# Altium project Eink.PrjPcb
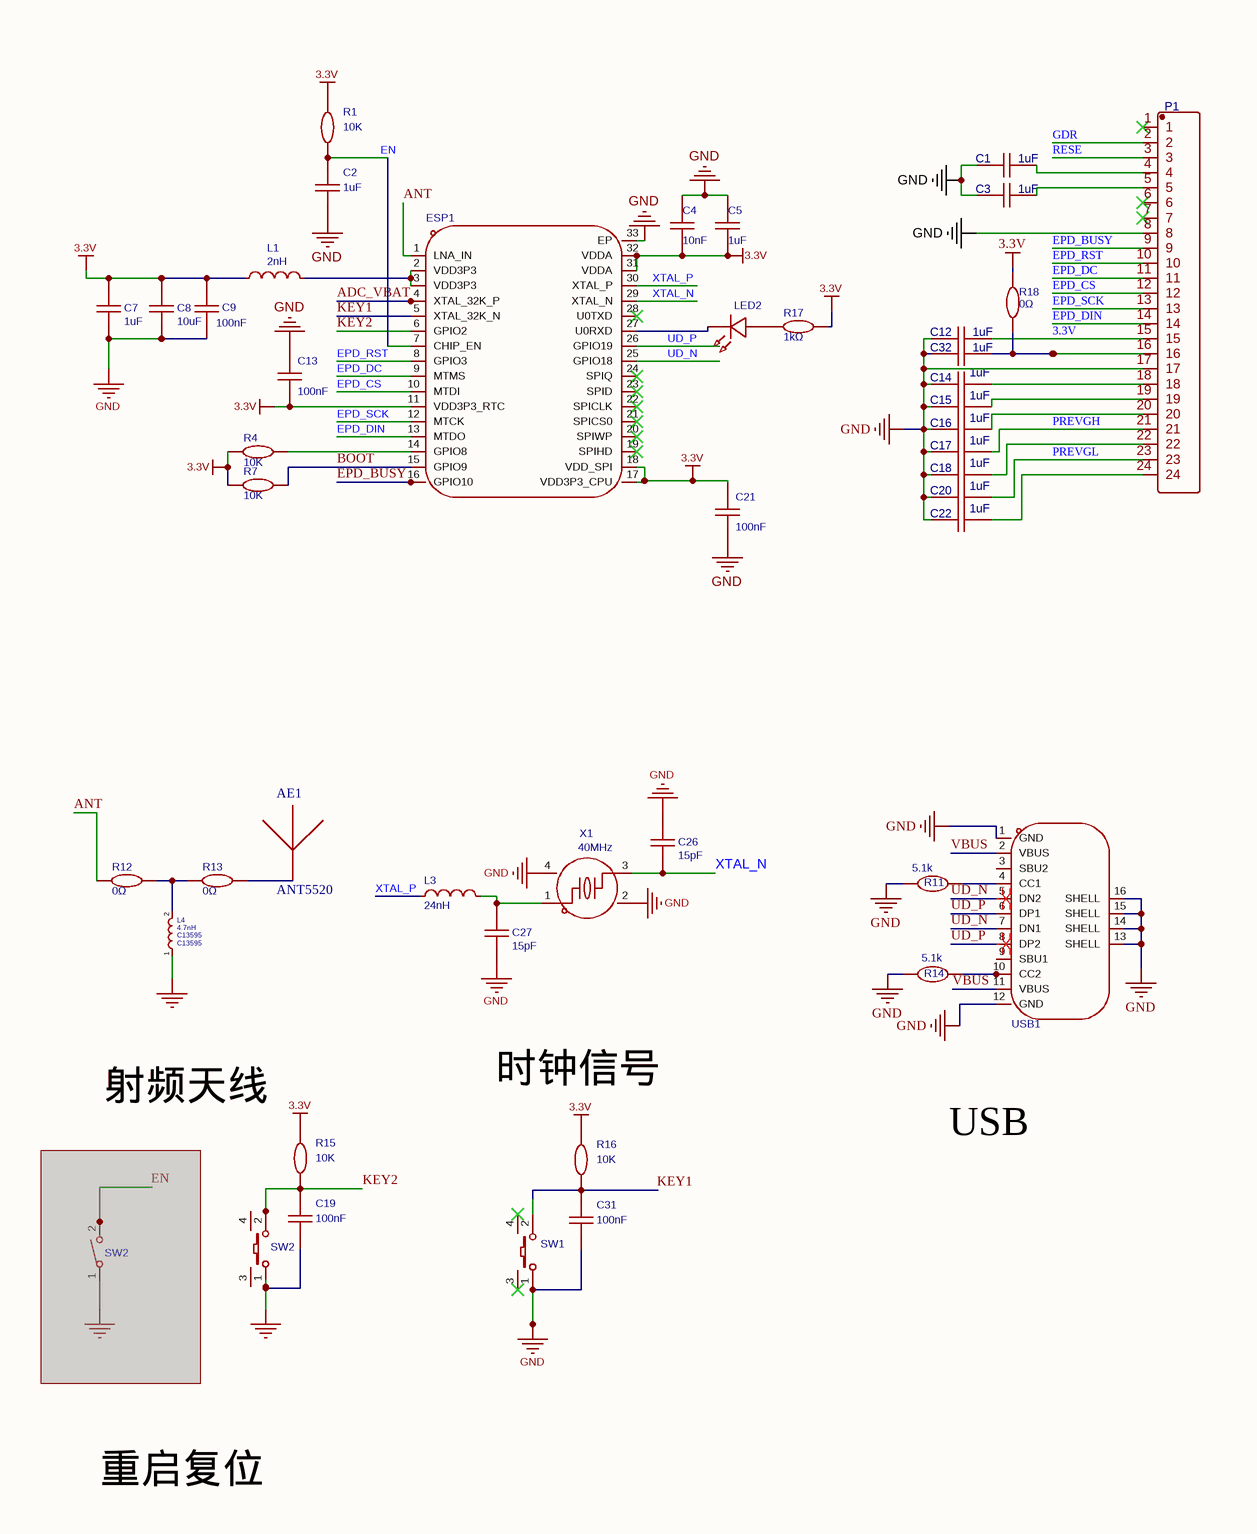
[diagram p0: Eink1.1.SchDoc, left]
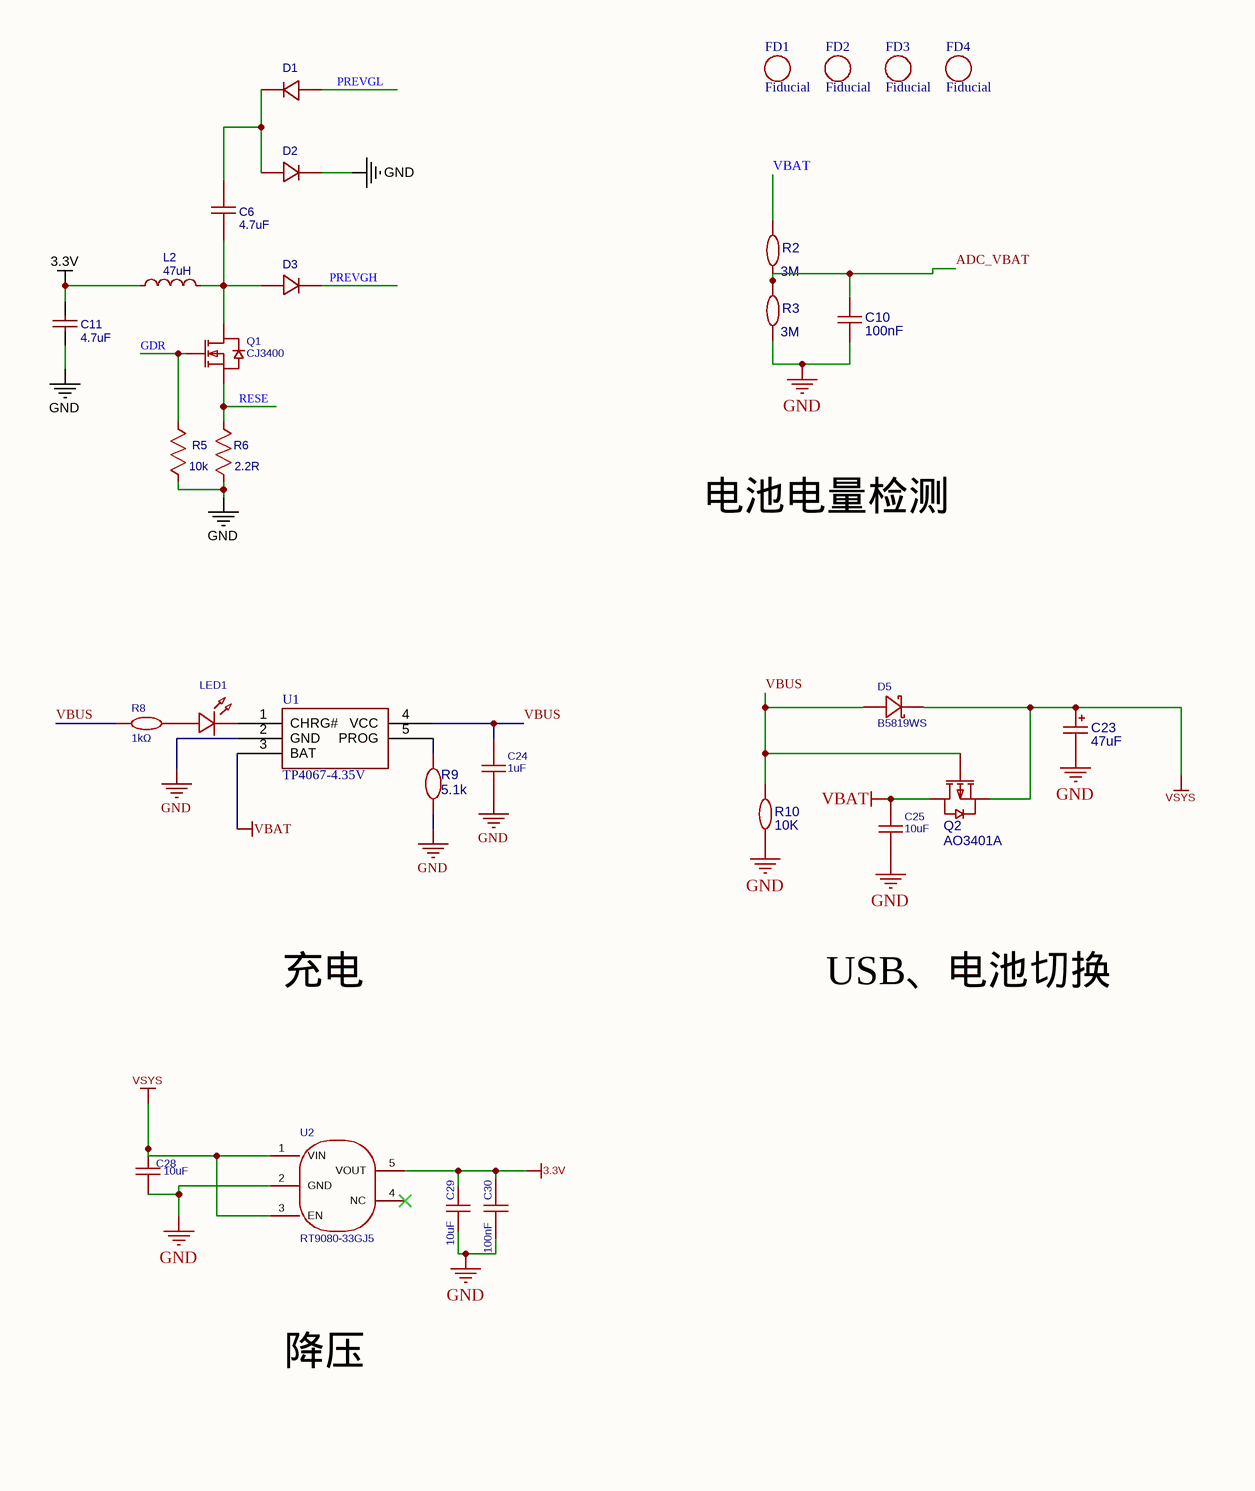
[diagram p1: Eink1.1.SchDoc, right]
1 sheet, 76 parts. Net scope: global (net labels, ports and power ports of the same name join across sheets).
Board file: Eink1.1.PcbDoc

## Sheet Eink1.1.SchDoc
size 431 x 279 mm; SheetNumber: 1; SheetTotal: 1

### Parts
(Parts that share a designator on the sheet are numbered #1, #2 ... from top to bottom, then left to right.)
AE1  ANT5520  [ANT_5520]
C1  1uF  [C0402]
C2  1uF  [C0402]
C3  1uF  [C0402]
C4  10nF  [C0402]
C5  1uF  [C0402]
C6  4.7uF  [C0402]
C7  1uF  [C0402]
C8  10uF  [C0402]
C9  100nF  [C0402]
C10  100nF  [C0402]
C11  4.7uF  [C0402]
C12  1uF  [C0402]
C13  100nF  [C0402]
C14  1uF  [C0402]
C15  1uF  [C0402]
C16  1uF  [C0402]
C17  1uF  [C0402]
C18  1uF  [C0402]
C19  100nF  [C0402]
C20  1uF  [C0402]
C21  100nF  [C0402]
C22  1uF  [C0402]
C23  47uF  [C0603]
C24  1uF  [C0402]
C25  10uF  [C0402]
C26  15pF  [C0402]
C27  15pF  [C0402]
C28  10uF  [C0402]
C29  10uF  [C0402]
C30  100nF  [C0402]
C31  100nF  [C0402]
C32  1uF  [C0402]
D1  MBR0530  [SOD-123_L2.8-W1.8-LS3.7-RD]  (value not drawn)
D2  MBR0530  [SOD-123_L2.8-W1.8-LS3.7-RD]  (value not drawn)
D3  MBR0530  [SOD-123_L2.8-W1.8-LS3.7-RD]  (value not drawn)
D5  B5819WS  [SOD-323_L1.7-W1.3-LS2.5-FD]
ESP1  ESP32-C3FH4  [QFN-32_L5.0-W5.0-P0.50-TL-EP3.7]  (value not drawn)
FD1  Fiducial  [FIDUCIAL_1MM]
FD2  Fiducial  [FIDUCIAL_1MM]
FD3  Fiducial  [FIDUCIAL_1MM]
FD4  Fiducial  [FIDUCIAL_1MM]
L1  2nH  [C0402]
L2  47uH  [L_L3_W3]
L3  24nH  [C0402]
L4  value 4.7nH  MNF PART NUMBER: C13595  [C0402]  (hidden comment: 3nH)
LED1  LED-0402-R  [C0402]  (value not drawn)
LED2  LED-0402-B  [C0402]  (value not drawn)
P1  FPC 0.5MM 24P Pull type H2.0mm Pick up  [FPC-SMD_24P-L17.5-W5.4-P0.50]  (value not drawn)
Q1  CJ3400  [SOT-23_L2.9-W1.3-P1.90-LS2.4-BR]
Q2  AO3401A  [SOT-23-3_L2.9-W1.6-P1.90-LS2.8-BR_1]
R1  10K  [R0402]
R2  3M  [R0402]
R3  3M  [R0402]
R4  10K  [R0402]
R5  10k  [R0402]
R6  2.2R  [R0402]
R7  10K  [R0402]
R8  1kΩ  [R0402]
R9  5.1k  [R0402]
R10  10K  [R0402]
R11  5.1k  [R0402]
R12  value 0Ω  [R0402]  (hidden comment: 0r)
R13  value 0Ω  [R0402]  (hidden comment: 0r)
R14  5.1k  [R0402]
R15  10K  [R0402]
R16  10K  [R0402]
R17  1kΩ  [R0402]
R18  value 0Ω  [R0402]  (hidden comment: 0r)
SW1  TS24CA 250gf 013  [SW-SMD_L4.7-W3.5-P3.35-EH]  (value not drawn)
SW2#1  TS24CA 250gf 013  [SW-SMD_L4.7-W3.5-P3.35-EH]  (value not drawn)
SW2#2  TS342A2P-WZ  [SW-SMD_L4.0-W2.9-LS5.0]  (value not drawn)  (masked out: inside a compile mask, not in the netlist)
U1  TP4067-4.35V  [SOT-23-5_L3.0-W1.7-P0.95-LS2.8-BL]
U2  RT9080-33GJ5  [SOT-23-5_L3.0-W1.7-P0.95-LS2.8-BL]
USB1  TYPEC  [USB-C-SMD_TYPEC-302-BRP16SC16]  (value not drawn)
X1  40MHz  [CRYSTAL-SMD_4P-L2.5-W2.0-BL]

### Nets
3.3V: C4.1 C5.1 C7.2 C8.2 C9.2 C11.2 C12.2 C13.1 C21.2 C29.2 C30.2 ESP1.11(VDD3P3_RTC) ESP1.17(VDD3P3_CPU) ESP1.18(VDD_SPI) ESP1.31(VDDA) ESP1.32(VDDA) L1.1 L2.1 P1.15 R1.2 R4.1 R7.1 R15.2 R16.2 R17.2 R18.2 U2.5(VOUT)
GND: C1.1 C2.1 C3.1 C4.2 C5.2 C7.1 C8.1 C9.1 C10.1 C11.1 C12.1 C13.2 C14.1 C15.1 C16.1 C17.1 C18.1 C19.1 C20.1 C21.1 C22.1 C23.2 C24.1 C25.1 C26.1 C27.2 C28.1 C29.1 C30.1 C31.1 C32.1 D2.1(C) ESP1.33(EP) L4.1 P1.8 P1.17 R3.1 R5.2 R6.2 R9.1 R10.1 R11.1 R14.1 SW1.1 SW2#1.1 U1.2(GND) U2.2(GND) USB1.1(GND) USB1.12(GND) USB1.13(SHELL) USB1.14(SHELL) USB1.15(SHELL) USB1.16(SHELL) X1.2(GND) X1.4(GND)
VBAT: C25.2 Q2.3(D) R2.2 U1.3(BAT)
VSYS: C23.1 C28.2 D5.2(K) Q2.2(S) U2.1(VIN) U2.3(EN)
ADC_VBAT: C10.2 ESP1.4(XTAL_32K_P) R2.1 R3.2
ANT: ESP1.1(LNA_IN) R12.1
BOOT: ESP1.15(GPIO9) R7.2
EN: C2.2 ESP1.7(CHIP_EN) R1.1
EPD_BUSY: ESP1.16(GPIO10) P1.9
EPD_CS: ESP1.10(MTDI) P1.12
EPD_DC: ESP1.9(MTMS) P1.11
EPD_DIN: ESP1.13(MTDO) P1.14
EPD_RST: ESP1.8(GPIO3) P1.10
EPD_SCK: ESP1.12(MTCK) P1.13
GDR: P1.2 Q1.1(G) R5.1
KEY1: C31.2 ESP1.5(XTAL_32K_N) R16.1 SW1.2
KEY2: C19.2 ESP1.6(GPIO2) R15.1 SW2#1.2
PREVGH: C17.2 D3.1(C) P1.21
PREVGL: C20.2 D1.2(A) P1.23
RESE: P1.3 Q1.2(S) R6.1
UD_N: ESP1.25(GPIO18) USB1.5(DN2) USB1.7(DN1)
UD_P: ESP1.26(GPIO19) USB1.6(DP1) USB1.8(DP2)
VBUS: C24.2 D5.1(A) Q2.1(G) R8.2 R10.2 U1.4(VCC) USB1.2(VBUS) USB1.11(VBUS)
XTAL_N: C26.2 ESP1.29(XTAL_N) X1.3
XTAL_P: ESP1.30(XTAL_P) L3.1
NetAE1_1: AE1.1(ANT) R13.2
NetC1_2: C1.2 P1.4
NetC3_2: C3.2 P1.5
NetC6_1: C6.1 D1.1(C) D2.2(A)
NetC6_2: C6.2 D3.2(A) L2.2 Q1.3(D)
NetC14_2: C14.2 P1.18
NetC15_2: C15.2 P1.19
NetC16_2: C16.2 P1.20
NetC18_2: C18.2 P1.22
NetC22_2: C22.2 P1.24
NetC27_1: C27.1 L3.2 X1.1
NetC32_2: C32.2 P1.16 R18.1
NetESP1_2: ESP1.2(VDD3P3) ESP1.3(VDD3P3) L1.2
NetESP1_14: ESP1.14(GPIO8) R4.2
NetESP1_27: ESP1.27(U0RXD) LED2.2
NetL4_2: L4.2 R12.2 R13.1
NetLED1_1: LED1.1 R8.1
NetLED1_2: LED1.2 U1.1(CHRG#)
NetLED2_1: LED2.1 R17.1
NetR9_2: R9.2 U1.5(PROG)
NetR11_2: R11.2 USB1.4(CC1)
NetR14_2: R14.2 USB1.10(CC2)

Not connected (* = marked no-connect by the designer): AE1 2; ESP1 19(SPIHD)* 20(SPIWP)* 21(SPICS0)* 22(SPICLK)* 23(SPID)* 24(SPIQ)* 28(U0TXD)*; P1 1* 6* 7*; SW1 3* 4*; SW2#1 3 4; U2 4(NC)*; USB1 3(SBU2) 9(SBU1)

### Layout directives
differential pair: UD_N, UD_P

### Notes on the sheet
- 电池电量检测
- 充电
- USB、电池切换
- (near R16) 时钟信号
- 射频天线
- USB
- 降压
- 重启复位
- DWG. NO.
- REV.
- SHT.
- THIS DOCUMENT AND THE DATA DISCLOSED HEREIN OR HEREWITH IS THE PROPERTY OF ALTIUM LIMITED AND MAY BE FREELY DISTRIBUTED IN WHOLE. NO RIGHTS ARE RESERVED OR EXPRESS OR IMPLIED WARANTEE GIVEN.
- REVISION
- DESCRIPTION
- DATE
- APPROVED
- ENG:
- APPROVALS
- PROJECT
- DSN:
- CHK:
- REFERENCE DOCUMENTS
- PROJECT REVISION:
- TITLE
- DOCUMENT REVISION:
- DESIGN ITEM:
- BOM:
- FAB DWG:
- PCB DWG:
- ASSY DWG:
- SCALE:
- SIZE
- B
- CAGE CODE
- FILE NAME
- DWG NO.
- SHEET
- OF
- REV

### Library data of the parts
AE1 = ANT_5520
C1 C3 C12 C14-C18 C20 C22 C32 = 105: nameAlias: Value(F); Contributor: LCEDA_Lib; spicePre: C; spiceSymbolName: C_0603_US
C2 C4 C5 C13 C19 C21 C31 = CAP_0603: ConvertToPcb: yes; SymbolName: CapAcitance; ModelId: ac125912035d415993ca9572d50418b1; ModelName: C0603_L1.6-W0.8-H0.8; ModelTransform: 62.992,31.496,0,0,0,0,0,0,0; Device: CAP_0603; AddInBom: yes; Supplier Footprint: 0603; FootprintName: C0402
  C2 C5: Value: 1uF
  C4: Value: 10nF
  C13 C19 C21 C31: Value: 100nF
C6 = 4.7uf: nameAlias: Value(F); Contributor: LCEDA_Lib; spicePre: C; spiceSymbolName: C_0603_US
C7 = 1UF: Add into BOM: yes; Origin Footprint: C0603; ModelId: fca5be93b99f4b5a9a2fd372d58c31d9; Symbol: 1UF; Device: 1UF; Convert to PCB: yes; FootprintName: C0603; ModelName: C0603
C8 C25 = 10UF: Add into BOM: yes; Origin Footprint: C0603; ModelId: fca5be93b99f4b5a9a2fd372d58c31d9; Symbol: 10UF; Device: 10UF; Convert to PCB: yes; FootprintName: C0603; ModelName: C0603
C9 = 100NF: Add into BOM: yes; Origin Footprint: C0603; ModelId: fca5be93b99f4b5a9a2fd372d58c31d9; Symbol: 100NF; Device: 100NF; Convert to PCB: yes; FootprintName: C0603; ModelName: C0603
C10 = CL21B104KBCNNNC: 容值:100nF;精度:±10%;额定电压:50V;材质(温度系数):X7R;; Manufacturer: SAMSUNG(三星); Symbol: 100nF_1; Add into BOM: yes; Origin Footprint: C0805; 3D Model: 1ba041120af144c991958decab20d241; 3D Model Transform: 78.74,51.181,0,0,0,0,0,0.0005,0; Tolerance: ±10%; Voltage Rated: 50V; Temperature Coefficient: X7R; ModelName: C0805_L2.0-W1.3-H1.3; Device: CL21B104KBCNNNC; Convert to PCB: yes; LCSC Part Name: 100nF ±10% 50V; Supplier Part: C1711; Manufacturer Part: CL21B104KBCNNNC; Supplier Footprint: 0805; JLCPCB Part Class: Extended Part; Datasheet: https://atta.szlcsc.com/upload/public/pdf/source/20160103/1457707693305.pdf; Supplier: LCSC; Value: 100nF; FootprintName: C0603
C11 = 4.7uF: Manufacturer: MuRata; Manufacturer Part: GRM31CR71H475KA12L; nameAlias: Capacitance; SMT Type: Extend; Supplier: LCSC; Supplier Part: C77096; JLCPCB SMD: Yes; spicePre: C; spiceSymbolName: GRM31CR71H475KA12L
C23 = CA45-B-10V-47uF-K: 容值:47uF;精度:±10%;额定电压:10V;等效串联电阻:2.4Ω@100kHz;; Manufacturer: CEC(振华新云); Add into BOM: yes; Origin Footprint: CAP-SMD_L3.5-W2.8-R-RD; 3D Model: b77bd53aeda446d2bdd09b0fdaf9418a; 3D Model Transform: 145.669,110.236,0,0,0,0,0,0,0; Tolerance: ±10%; Rated Voltage: 10V; ModelName: CASE-B_L3.5-W2.8-H1.9; Symbol: 47uF; Device: CA45-B-10V-47uF-K; Convert to PCB: yes; LCSC Part Name: 47uF ±10% 10V; Supplier Part: C136658; Manufacturer Part: CA45-B-10V-47uF-K; Supplier Footprint: CASE-B-3528; JLCPCB Part Class: Extended Part; Datasheet: https://atta.szlcsc.com/upload/public/pdf/source/20171123/C136658_15114108124621137439.pdf; Supplier: LCSC; Value: 47uF; Equivalent Series Resistance(ESR): 2.4Ω@100kHz; Operating Temperature: -55℃~+125℃; FootprintName: CASE-B_3528
C24 = 1uF: Add into BOM: yes; Origin Footprint: C0603; ModelId: fca5be93b99f4b5a9a2fd372d58c31d9; Symbol: 1UF; Device: 1UF; Convert to PCB: yes; FootprintName: C0603; ModelName: C0603
C26 C27 = 10PF: Add into BOM: yes; ModelId: fca5be93b99f4b5a9a2fd372d58c31d9; ModelName: C0603; Symbol: 10PF; Device: 10PF; Convert to PCB: yes; FootprintName: C0603
  C26: Origin Footprint: C0603
C28 C29 = CL21A106KAYNNNE_C15850: 容值:10uF;精度:±10%;额定电压:25V;材质(温度系数):X5R;; Manufacturer: SAMSUNG(三星); 3D Model: 1ba041120af144c991958decab20d241; 3D Model Transform: 78.74,51.181,0,0,0,0,0,0.0005,0; Tolerance: ±10%; Voltage Rated: 25V; Temperature Coefficient: X5R; AddInBom: yes; ModelName: C0805_L2.0-W1.3-H1.3; Symbol: CL21A106KAYNNNE; Device: CL21A106KAYNNNE_C15850; LCSC Part Name: 10uF ±10% 25V; Manufacturer Part: CL21A106KAYNNNE; Supplier Footprint: 0805; JLCPCB Part Class: 基础库; Datasheet: https://atta.szlcsc.com/upload/public/pdf/source/20160103/1457707679302.pdf; Supplier: LCSC; Value: 10UF; ConvertToPcb: yes; FootprintName: C0805
C30 = CC0603KRX7R9BB104: 容值:100nF;精度:±10%;额定电压:50V;材质(温度系数):X7R;; Manufacturer: YAGEO(国巨); 3D Model: ac125912035d415993ca9572d50418b1; 3D Model Transform: 62.992,31.496,0,0,0,0,0,0,0; Tolerance: ±10%; Voltage Rated: 50V; Temperature Coefficient: X7R; AddInBom: yes; ModelName: C0603_L1.6-W0.8-H0.8; Symbol: CC0603KRX7R9BB104; Device: CC0603KRX7R9BB104; LCSC Part Name: 100nF ±10% 50V; Manufacturer Part: CC0603KRX7R9BB104; Supplier Footprint: 0603; JLCPCB Part Class: 基础库; Datasheet: https://atta.szlcsc.com/upload/public/pdf/source/20180910/C282072_33301C7F631E79921B82A8DAC6BCC5B3.pdf; Supplier: LCSC; Value: 100NF; ConvertToPcb: yes; FootprintName: C0603
D1-D3 = MBR0530: Manufacturer: CJ; SMT Type: Extend; Supplier: LCSC; Manufacturer Part: MBR0530; image: //image.lceda.cn/szlcsc/C77336.jpg; Supplier Part: C77336; LCSC Assembly: Yes; spicePre: D; spiceSymbolName: MBR0530
D5 = B5819WS_C7420331: 二极管配置:独立式;正向压降(Vf):600mV@1.0A;直流反向耐压(Vr):40V;整流电流:1A;; Manufacturer: R+O(宏嘉诚); Symbol: B5819WS_C7420331_1; 3D Model: 0f2f330c645944df9245ac3c3fec3456聨0819f05c4eef4c71ace90d822a990e87; 3D Model Transform: 98.425,49.2125,0,180,0,0,0,0,0; Diode Configuration: 独立式; Voltage - DC Reverse(Vr): 40V; Current - Rectified: 1A; Reverse Leakage Current (Ir): 1mA@40V; Operating Junction Temperature Range: -55℃~+150℃; Non-Repetitive Peak Forward Surge Current: 10A; AddInBom: yes; Device: B5819WS_C7420331; LCSC Part Name: 电压:40V 电流:1A; Supplier Part: C7420331; Manufacturer Part: B5819WS; Supplier Footprint: SOD-323; JLCPCB Part Class: Extended Part; Datasheet: https://item.szlcsc.com/datasheet/B5819WS/8397153.html; Supplier: LCSC; Voltage - Forward(Vf@If): 600mV@1.0A; ConvertToPcb: yes; FootprintName: SOD-323_L1.7-W1.3-LS2.5-FD; ModelName: SOD-323_L1.7-W1.3-LS2.5-FD; Forward Voltage (Vf@If): 600mV@1.0A; Reverse Voltage (Vr): 40V; Rectified Current: 1A
ESP1 = ESP32-C3FH4: Manufacturer: ESPRESSIF(乐鑫); AddInBom: yes; ModelId: 1b373353bf024628a0546c2e0a05c449; ModelName: QFN-32_L5.0-W5.0-H0.9-P0.50-TL-EP3.7; ModelTransform: 196.85,196.85,0,0,0,0,0,0,0; Symbol: ESP32-C3FH4; Device: ESP32-C3FH4; Supplier: LCSC; Supplier Part: C2858491; Manufacturer Part: ESP32-C3FH4; JLCPCB Part Class: 扩展库; LCSC Part Name: ESP32-C3FH4; Supplier Footprint: QFN-32-EP(5x5); Datasheet: https://atta.szlcsc.com/upload/public/pdf/source/20231220/86199E4714F7A99F6AA9401EA48CDBDA.pdf; ConvertToPcb: yes; FootprintName: QFN-32_L5.0-W5.0-P0.50-TL-EP3.7
L1 = 2nH: Add into BOM: yes; Origin Footprint: L0603; Symbol: 2nH; Device: 2nH; Convert to PCB: yes; FootprintName: L0603
L2 = 68uH: Manufacturer: Sunlord; Manufacturer Part: SWPA6045S680MT; nameAlias: Inductance; Supplier: LCSC; Supplier Part: C53663; spicePre: L; spiceSymbolName: SWPA6045S680MT
L3 = 24nH: Add into BOM: yes; Origin Footprint: L0603; Symbol: 24nH; Device: 24nH; Convert to PCB: yes; FootprintName: L0603
L4 = Device_L: Inductor; ki_keywords: inductor choke coil reactor magnetic; ki_fp_filters: Choke_* *Coil* Inductor_* L_*; UniqueId: 01f5988480b85854; Attribute1: L6; AddInBom: yes; Device: Device_L; Symbol: Device_L; UserDocLink: ~; LCSC: C13595; FootprintName: Inductor_SMD:L_0402_1005Metric
LED1 LED2 = LED-0603_G: Manufacturer: EVERLIGHT(台湾亿光); Manufacturer Part: 19-217/GHC-YR1S2/3T; Add into BOM: yes; Origin Footprint: LED0603_GREEN; ModelId: 8b5fcaf0229049f8a37a9c352bb0ca0a; Symbol: LED-0603_G; Device: LED-0603_G; Convert to PCB: yes; Supplier Part: C72043; Supplier: LCSC; FootprintName: LED0603_GREEN; ModelName: LED-0603_G
P1 = FPC 0.5MM 24P Pull type H2.0mm Pick up: Manufacturer: ReliaPro; spicePre: X; Supplier: LCSC; Manufacturer Part: FPC 0.5MM 24P Pull type H2.0mm Pick up; image: //image.lceda.cn/szlcsc/C11092.jpg; Supplier Part: C11092; spiceSymbolName: FPC 0.5MM 24P Pull type H2.0mm Pick up
Q1 = CJ3400: 类型:N沟道;漏源电压(Vdss):30V;连续漏极电流(Id):5.8A;功率(Pd):350mW;导通电阻(RDS(on)@Vgs,Id):35mΩ@10V,5.8A;阈值电压(Vgs(th)@Id):1.4V@250uA;; Manufacturer: CJ(江苏长电/长晶); AddInBom: yes; ModelId: c62791f0466c4ae2a892c056b845b0ca; ModelName: SOT-23-3P_L2.9-W1.3-H1.0-LS2.4-P0.95; ModelTransform: 98.64468,114.173,0,180,0,0,0,0,0; Type: N沟道; Drain Source Voltage (Vdss): 30V; Power Dissipation (Pd): 350mW; Symbol: CJ3400; Device: CJ3400; LCSC Part Name: N沟道 30V 5.8A; SupplierPart: C19019; ManufacturerPart: CJ3400; Supplier Footprint: SOT-23; JLCPCB Part Class: Extended Part; Datasheet: https://atta.szlcsc.com/upload/public/pdf/source/20140809/1457707205786.pdf; Supplier: LCSC; ConvertToPcb: yes; FootprintName: SOT-23_L2.9-W1.3-P1.90-LS2.4-BR; Continuous Drain Current (Id): 5.8A; Drain Source On Resistance (RDS(on)@Vgs,Id): 35mΩ@10V,5.8A; Gate Threshold Voltage (Vgs(th)@Id): 1.4V@250uA
Q2 = CJ3401_1: 类型:P沟道;漏源电压(Vdss):30V;连续漏极电流(Id):4.2A;功率(Pd):350mW;导通电阻(RDS(on)@Vgs,Id):65mΩ@10V,4.2A;; Manufacturer: CJ(江苏长电/长晶); Symbol: CJ3401; Add into BOM: yes; Origin Footprint: SOT-23-3_L2.9-W1.6-P1.90-LS2.8-BR; 3D Model: 89cb27a44ab2466697082bb9fd73a7d0; 3D Model Transform: 110.236,114.173,0,180,0,0,-0.005,0.0005,0; Type: P沟道; Drain Source Voltage (Vdss): 30V; Power Dissipation (Pd): 350mW; Gate Threshold Voltage (Vgs(th)@Id): 1.3V@250uA; ModelName: SOT-23-3L_L2.9-W1.6-H1.1-LS2.8-P0.95; Device: CJ3401_1; Convert to PCB: yes; LCSC Part Name: P沟道 30V 4.2A; Supplier Part: C13799; Manufacturer Part: CJ3401; Supplier Footprint: SOT-23; JLCPCB Part Class: Extended Part; Datasheet: https://atta.szlcsc.com/upload/public/pdf/source/20140815/1457707217656.pdf; Supplier: LCSC; Continuous Drain Current (Id): 4.2A; Drain Source On Resistance (RDS(on)@Vgs,Id): 65mΩ@10V,4.2A; FootprintName: SOT-23-3_L2.9-W1.6-P1.90-LS2.8-BR_1
R1 R4 R7 R15 R16 = Res_0603: Symbol: 电阻; ConvertToPcb: yes; ModelId: fc143cca1e79419f9cd78b61e9279f08; ModelName: R0603; ModelTransform: 31.8897,63.7794,0,90,0,0,0,0,0; Value: 10K; Device: Res_0603; AddInBom: yes; Supplier Footprint: 0603; FootprintName: R0402
R2 R3 = AC0805FR-0710KL: 电阻类型:厚膜电阻;阻值:10kΩ;精度:±1%;功率:125mW;; Manufacturer: YAGEO(国巨); Symbol: 10K_1; Add into BOM: yes; Value: 100kΩ; Origin Footprint: R0805; 3D Model: 37a81e68749a4138bd2dfa6897b24b85; 3D Model Transform: 78.74,51.181,0,0,0,0,0,-0.0005,0; Tolerance: ±1%; Power(Watts): 125mW; Temperature Coefficient: ±100ppm/℃; Overload Voltage (Max): 150V; ModelName: R0805_L2.0-W1.3-H0.6; Device: AC0805FR-0710KL; Convert to PCB: yes; Resistance: 100kΩ; LCSC Part Name: 10kΩ ±1% 125mW; Manufacturer Part: AC0805FR-0710KL; Supplier Footprint: 0805; JLCPCB Part Class: Extended Part; Datasheet: https://atta.szlcsc.com/upload/public/pdf/source/20171113/C140868_15105613027091115785.pdf; Supplier: LCSC; Type: 厚膜电阻; Operating Temperature Range: -55℃~+155℃; FootprintName: R0603
R5 = 10k: nameAlias: Value(Ω); Contributor: LCEDA_Lib; spicePre: R; spiceSymbolName: R_0603_US
R6 = 2.2R: nameAlias: Value(Ω); Contributor: LCEDA_Lib; spicePre: R; spiceSymbolName: R_0603_US
R8 R17 = 0603WAF1001T5E: 电阻类型:厚膜电阻;阻值:1kΩ;精度:±1%;功率:100mW;工作电压:75V;温度系数:±100ppm/℃;; Manufacturer: UNI-ROYAL(厚声); Add into BOM: yes; 3D Model: fc143cca1e79419f9cd78b61e9279f08; 3D Model Transform: 31.8897,63.7794,0,90,0,0,0,0,0; Tolerance: ±1%; Power(Watts): 100mW; Voltage-Supply(Max): 75V; ModelName: R0603; Symbol: 0603WAF1001T5E; Device: 0603WAF1001T5E; Convert to PCB: yes; Supplier Part: C21190; Supplier: LCSC; Manufacturer Part: 0603WAF1001T5E; LCSC Part Name: 1kΩ ±1% 100mW 厚膜电阻; Supplier Footprint: 0603; JLCPCB Part Class: Basic Part; Datasheet: https://item.szlcsc.com/datasheet/0603WAF1001T5E/21904.html; Type: 厚膜电阻; Value: 1kΩ; Temperature Coefficient: ±100ppm/℃; Operating Temperature: -55℃~+155℃; FootprintName: R0603
R9 = 4.7K: Add into BOM: yes; 3D Model: 6bd5cd867e9542ebae21caaf5d2d4c4d; 3D Model Transform: v2:[2.410722045565656e-15,39.37007874015748,0,-39.37007874015748,2.410722045565656e-15,0,0,0,39.37007874015748,0,0,0]; ModelName: R0603; Symbol: 4.7K; Device: 4.7K; Convert to PCB: yes; FootprintName: R0603
R10 = AC0805FR-0710KL: 电阻类型:厚膜电阻;阻值:10kΩ;精度:±1%;功率:125mW;; Manufacturer: YAGEO(国巨); Symbol: 10K_1; Add into BOM: yes; Origin Footprint: R0805; Resistance: 10kΩ; 3D Model: 37a81e68749a4138bd2dfa6897b24b85; 3D Model Transform: 78.74,51.181,0,0,0,0,0,-0.0005,0; Value: 10kΩ; Tolerance: ±1%; Power(Watts): 125mW; Temperature Coefficient: ±100ppm/℃; Overload Voltage (Max): 150V; ModelName: R0805_L2.0-W1.3-H0.6; Device: AC0805FR-0710KL; Convert to PCB: yes; LCSC Part Name: 10kΩ ±1% 125mW; Supplier Part: C140868; Manufacturer Part: AC0805FR-0710KL; Supplier Footprint: 0805; JLCPCB Part Class: Extended Part; Datasheet: https://atta.szlcsc.com/upload/public/pdf/source/20171113/C140868_15105613027091115785.pdf; Supplier: LCSC; Type: 厚膜电阻; Operating Temperature Range: -55℃~+155℃; FootprintName: R0603
R11 R14 = 5.1k: Add into BOM: yes; Origin Footprint: R0603; ModelId: fc143cca1e79419f9cd78b61e9279f08; Symbol: 5.1k; Device: 5.1k; Convert to PCB: yes; FootprintName: R0603; ModelName: R0603
R12 R13 R18 = 0402WGF0000TCE: 阻值:0Ω;精度:±1%;功率:62.5mW;温度系数:±800ppm/℃;电阻类型:厚膜电阻;; Manufacturer: UNI-ROYAL(厚声); AddInBom: yes; ModelId: 671aefced39d4c318694bba8bd8efd39; ModelName: R0402_L1.0-W0.5-H0.5; ModelTransform: 39.37,19.685,0,0,0,0,0,0.0005,0; Tolerance: ±1%; Power(Watts): 62.5mW; Overload Voltage (Max): 50V; JLCPCB Part Class: Basic Part; Symbol: 0402WGF0000TCE; Device: 0402WGF0000TCE; Supplier: LCSC; Manufacturer Part: 0402WGF0000TCE; Supplier Part: C17168; LCSC Part Name: 0Ω ±1% 62.5mW 厚膜电阻; Supplier Footprint: 0402; Datasheet: https://atta.szlcsc.com/upload/public/pdf/source/20200306/C422600_1E6D84923E4A46A82E41ADD87F860B5C.pdf; ConvertToPcb: yes; FootprintName: R0402; Temperature Coefficient: ±800ppm/℃; Type: 厚膜电阻; Operating Temperature Range: -55℃~+155℃
SW1 SW2#1 = TS24CA 250gf 013: 电路结构:单刀单掷;按钮形状:矩形按钮;作用力:250gf;安装方式:卧贴;开关长度:4.55mm;开关宽度:1.8mm;开关高度:3.5mm;带支架:不带;触点电流:50mA;额定电压(AC):-;额定电压(DC):12V;额定功率:0.6W;绝缘电阻:100MΩ;带灯:无;机械寿命:3万次;; Manufacturer: SHOU HAN(首韩); AddInBom: yes; ModelId: 763936bace60400091d42d91968ac4d8; ModelName: SW-SMD_L4.7-W3.5-H1.9-P3.35-EH; ModelTransform: 185.039,143.691,0,0,0,0,0,23.974,-15.748; Circuit: 单刀单掷; Actuator Style: 矩形按钮; Switch Length: 4.55mm; Switch Width: 1.8mm; Switch Height: 3.5mm; Strike Gundam: 不带; Contact Current: 50mA; Voltage Rating (DC): 12V; Power Rating: 0.6W; Insulation Resistance: 100MΩ; Actuator/Cap Color: 黑色; With Lamp: 无; Mechanical Life: 3万次; Symbol: TS24CA 250GF 013; Device: TS24CA 250gf 013; LCSC Part Name: 2*4*3.5mm半包小贝贝TS-018小侧按键m165蓝牙耳机开关 250gf; SupplierPart: C5373430; ManufacturerPart: TS24CA 250gf 013; Supplier Footprint: SMD; JLCPCB Part Class: 扩展库; Datasheet: https://atta.szlcsc.com/upload/public/pdf/source/20230321/913029B0FB0CD391AF5EFD51697D8EC4.pdf; Supplier: LCSC; ConvertToPcb: yes; FootprintName: SW-SMD_L4.7-W3.5-P3.35-EH; Operating Force: 250gf; Mounting Style: 卧贴; Voltage Rating (AC): -; IP Rating: -; Pin Style: -; Operating Temperature: -40℃~+85℃
SW2#2 = TS342A2P-WZ: Manufacturer: SHOU HAN(首韩); AddInBom: yes; ModelId: 63599cce708d48afbce1b0db00354477; ModelName: SW-SMD_L4.0-W2.9-H2-LS5.0; ModelTransform: 196.85,114.173,0,0,0,0,0,0,0; Symbol: TS342A2P-WZ; Device: TS342A2P-WZ; LCSC Part Name: 轻触开关 3*4*2 两脚小龟不带柱 250gf 黑色塑胶按钮; SupplierPart: C557591; ManufacturerPart: TS342A2P-WZ; Supplier Footprint: SMD; JLCPCB Part Class: Extended Part; Datasheet: https://atta.szlcsc.com/upload/public/pdf/source/20200519/C557591_B3A5A21584733303F06306F18577DA8B.pdf; Supplier: LCSC; ConvertToPcb: yes; FootprintName: SW-SMD_L4.0-W2.9-LS5.0
U1 = LTC4054
U2 = RT9013-33GB: 输出类型:固定;输出极性:正;最大输入电压:5.5V;输出电压:3.3V;输出电流:500mA;电源纹波抑制比(PSRR):50dB@(10kHz);; Manufacturer: RICHTEK(立锜); 3D Model: 0a2a1b8f50944f73965918ad6e5fe167; 3D Model Transform: 118.60433,114.173,0,90,0,0,0.0005,0.0005,0; Output Type: 固定; Output Polarity: 正; Number of Outputs: 1; Maximum Input Voltage: 5.5V; Output Voltage: 3.3V; Dropout Voltage: 400mV@(500mA); Quiescent Current (Ground Current): 50uA; Output Current: 500mA; AddInBom: yes; ModelName: SOT-23-5_L2.9-W1.6-H1.1-LS2.8-P0.95; Symbol: RT9013-33GB; Device: RT9013-33GB; LCSC Part Name: 输入5.5V 输出3.3V 500mA; Supplier Footprint: SOT-23-5; Datasheet: https://atta.szlcsc.com/upload/public/pdf/source/20150504/1457707282459.pdf; Power Supply Rejection Ratio (PSRR): 50dB@(10kHz); Noise: -; Feature: -; Operating Temperature: -40℃~+85℃; Supplier: LCSC; Manufacturer Part: RT9013-33GB; Supplier Part: C47773; JLCPCB Part Class: 扩展库; ConvertToPcb: yes; FootprintName: SOT-23-5_L3.0-W1.7-P0.95-LS2.8-BL
USB1 = TYPEC-沉板1.6mm: 连接器类型:Type-C;标准:USB 3.1;公母:母;端口数量:1;触点数量:16P;安装方式:沉板;额定电流 - 电源:5A;工作温度范围:-45℃~+85℃;焊接温度(最大值):260℃;; Manufacturer: XUNPU(讯普); ManufacturerPart: TYPEC-302-BRP16SC16; AddInBom: yes; ModelId: 83e9ad9c543d46a9a9a2dd567b3f71cf; ModelTransform: 454.33,283.464,0,0,0,0,0,-41.337,-62.992; Connector Type: Type-C; Gender: 母; Number of Ports: 1; Number of Contacts: 16P; Current Rating - Power (Max): 5A; Soldering Temperature(Max): 260℃; Symbol: TYPEC-沉板1.6mm; Device: TYPEC-沉板1.6mm; LCSC Part Name: Type-C 母 沉板; SupplierPart: C2835313; Supplier Footprint: SMD; JLCPCB Part Class: Extended Part; Datasheet: https://atta.szlcsc.com/upload/public/pdf/source/20210629/C2835313_96CAAD9C15DFF4F1D03DDC0B4E6AD92A.pdf; Supplier: LCSC; ConvertToPcb: yes; FootprintName: USB-C-SMD_TYPEC-302-BRP16SC16; ModelName: USB-C-SMD_TYPEC-302-BRP16SC16; Standard: USB 3.1; Mounting Style: 沉板; Operating Temperature Range: -45℃~+85℃
X1 = 40MHz: Manufacturer: JGHC(晶光华); Add into BOM: yes; ModelId: d23e0abc26e54c15b6292fd5f43702fa; Symbol: 40MHz; Device: 40MHz; Convert to PCB: yes; Origin Footprint: CRYSTAL-SMD_4P-L2.5-W2.0-BL; Supplier: LCSC; Supplier Part: C555614; JLCPCB Part Class: Extended Part; FootprintName: CRYSTAL-SMD_4P-L2.5-W2.0-BL; ModelName: CRYSTAL-SMD_4P-L2.5-W2.0-BL